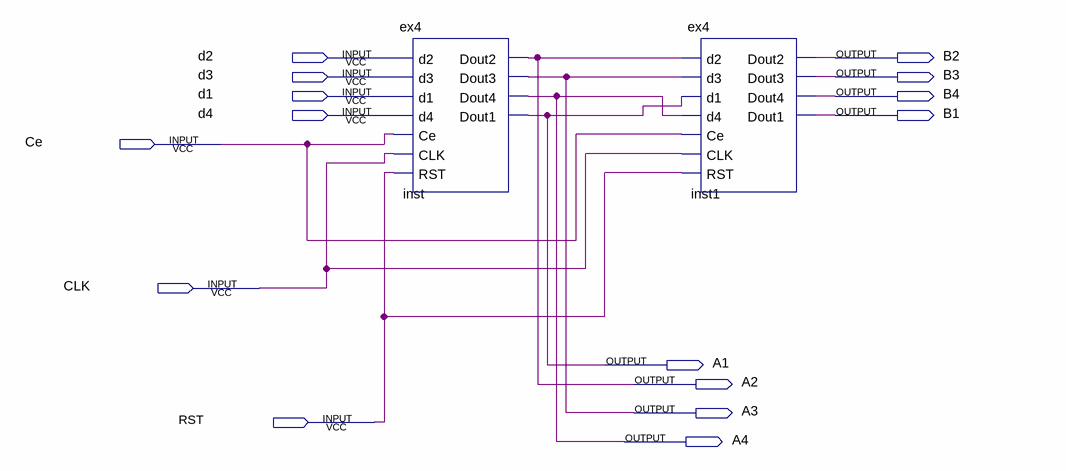
[diagram p0: schematic sheet]
// Quartus schematic ex5.bdf as structural Verilog: 2 symbols, 15 pins
module ex5 (
  input  d2,
  input  d3,
  input  d1,
  input  d4,
  input  Ce,
  input  CLK,
  input  RST,
  output B2,
  output B3,
  output B4,
  output B1,
  output A1,
  output A2,
  output A3,
  output A4
);

  ex4 inst (
    .d2(d2), .d3(d3), .d1(d1), .d4(d4), .Ce(Ce), .CLK(CLK), .RST(RST), .Dout2(A2), .Dout3(A3), .Dout4(A4),
    .Dout1(A1));
  ex4 inst1 (
    .d2(A2), .d3(A3), .d1(A1), .d4(A4), .Ce(Ce), .CLK(CLK), .RST(RST), .Dout2(B2), .Dout3(B3), .Dout4(B4),
    .Dout1(B1));
endmodule
